# Altium project LCDTestor.PrjPcb
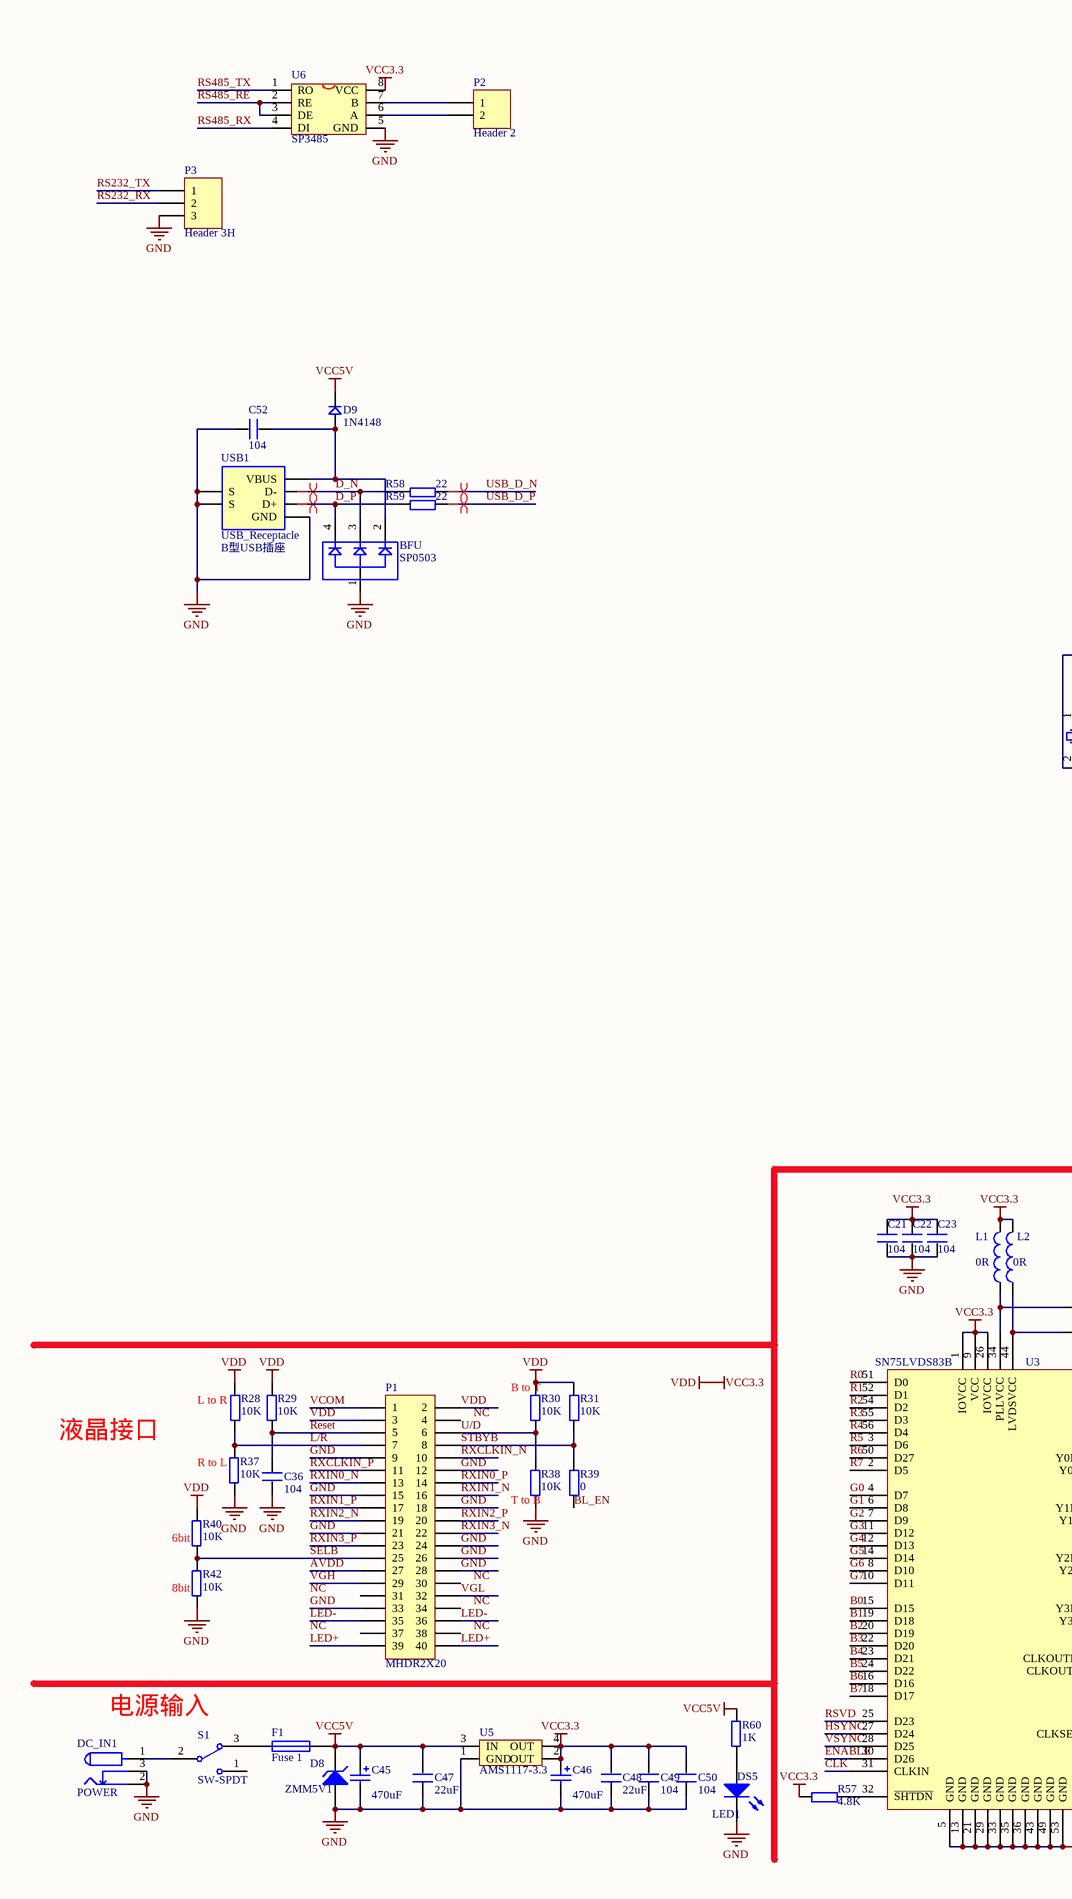
[diagram p0: LCD TEST BOART-A8.SchDoc, left]
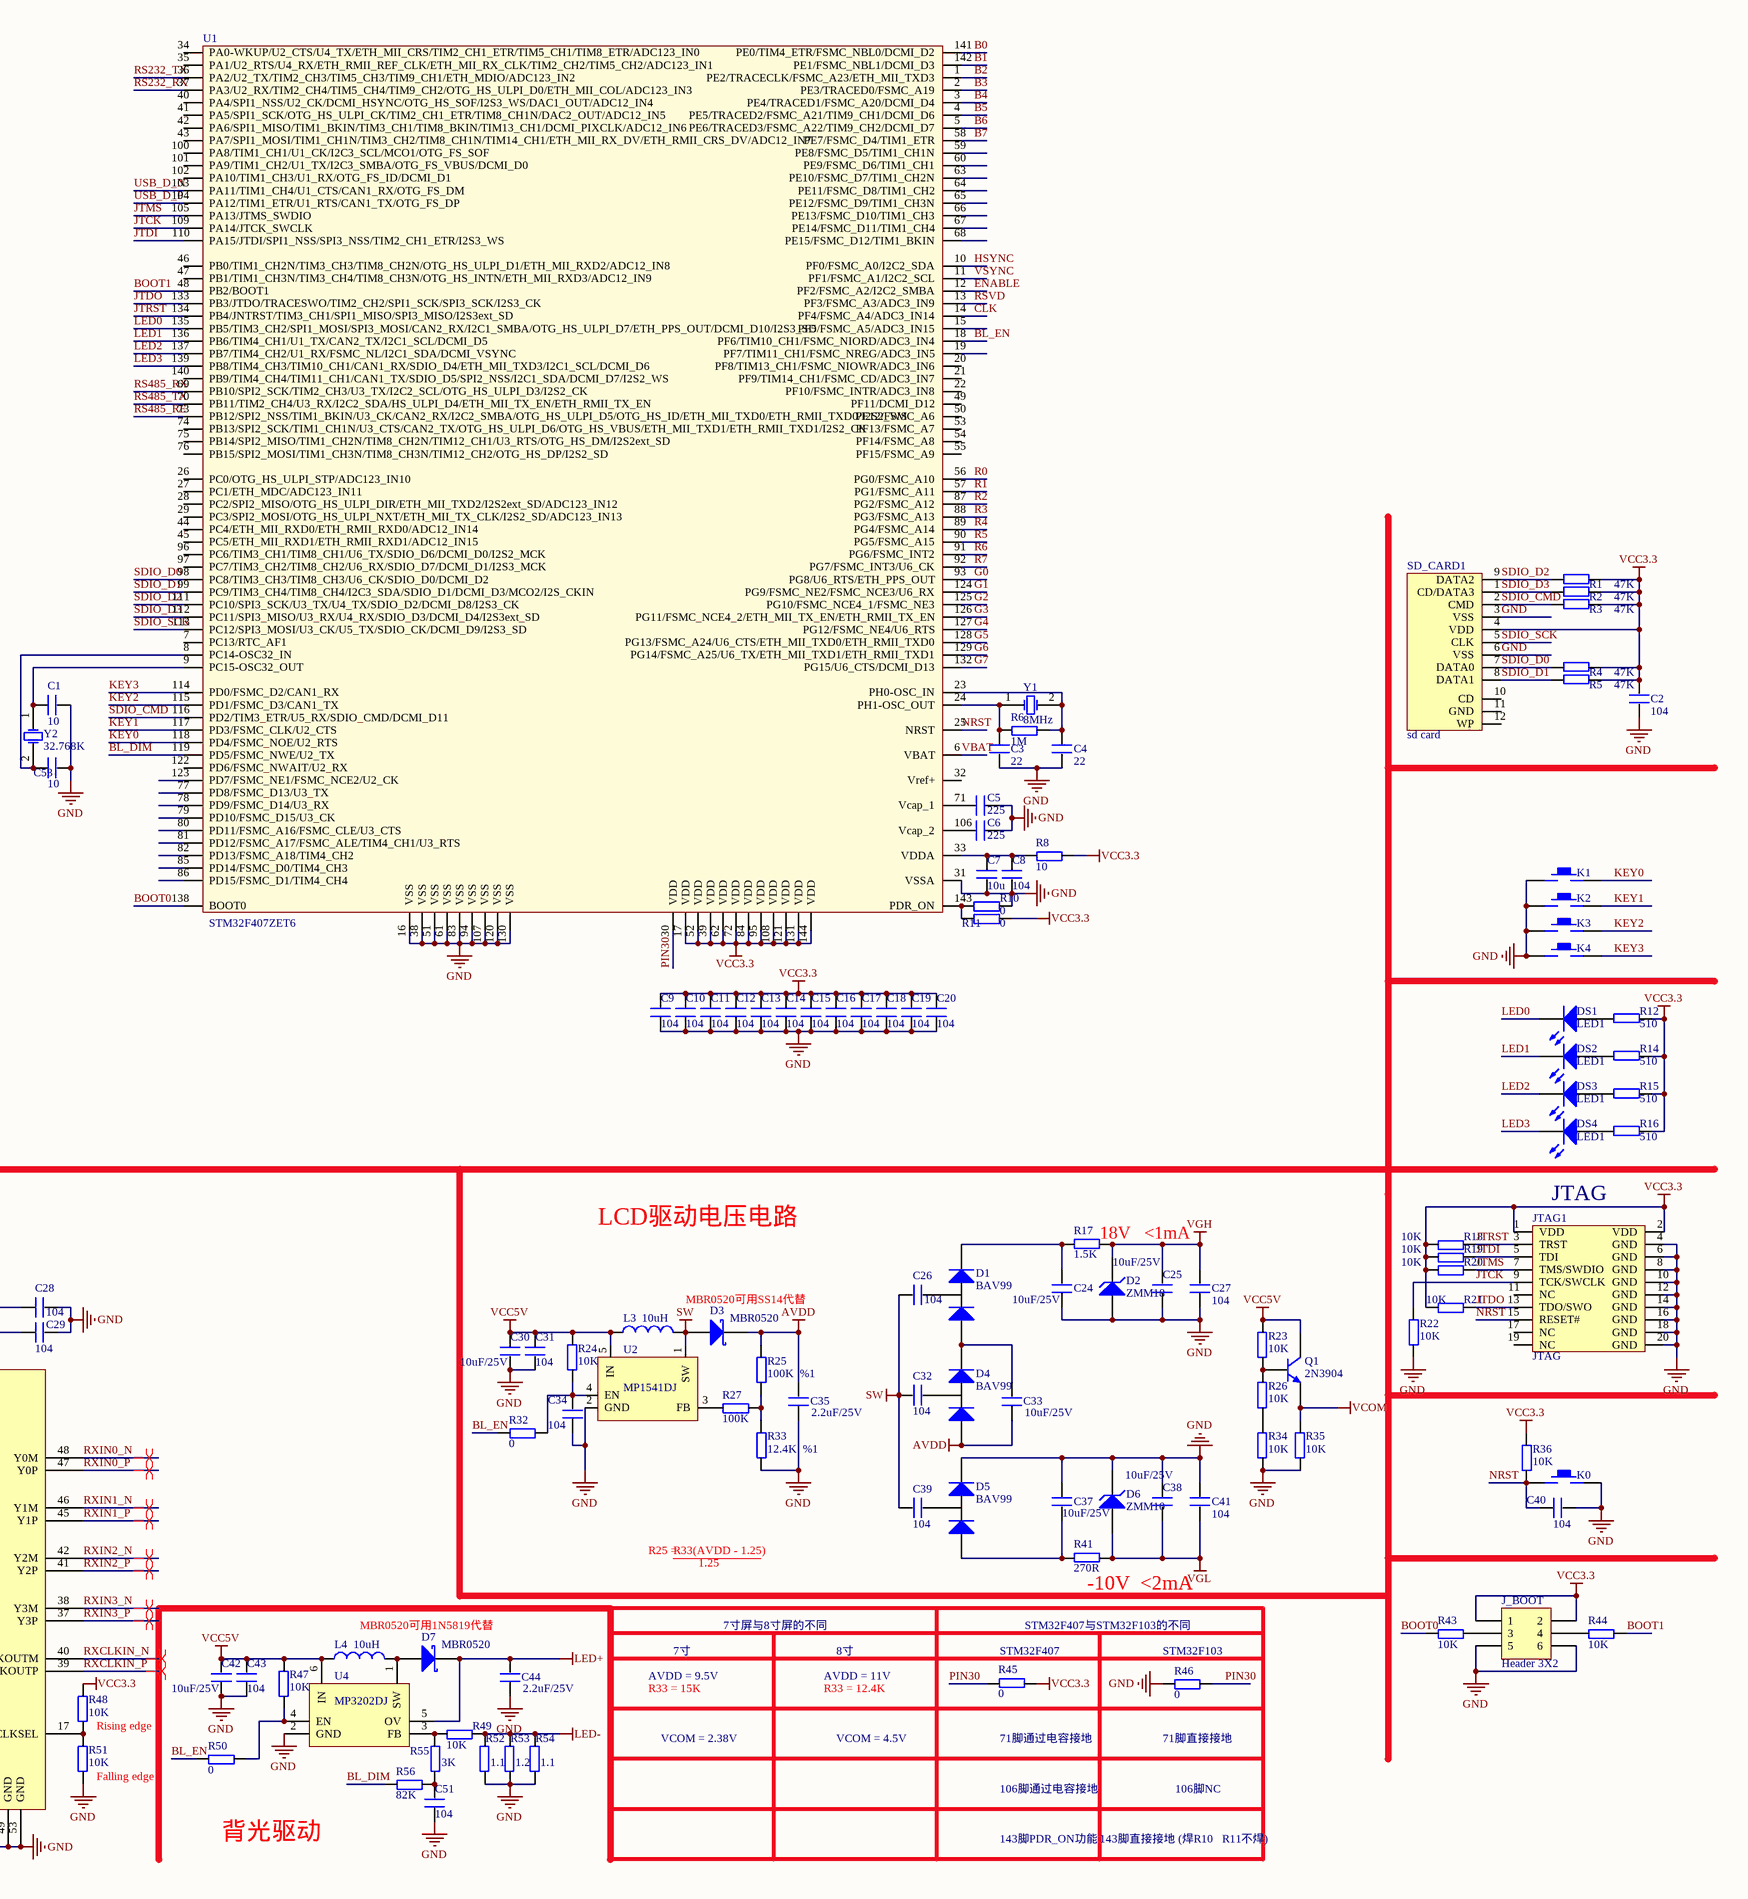
[diagram p1: LCD TEST BOART-A8.SchDoc, right]
1 sheet, 153 parts. Net scope: global (net labels, ports and power ports of the same name join across sheets).
Board file: LCD TEST BOART-A8.PcbDoc

## Sheet LCD TEST BOART-A8.SchDoc
size A2

### Parts
BFU  SP0503  [SOT143]
C1  10  [0603P]
C2  104  [0603P]
C3  22  [0603P]
C4  22  [0603P]
C5  225  [0603P]
C6  225  [0603P]
C7  10u  [0603P]
C8  104  [0603P]
C9  104  [0603P]
C10  104  [0603P]
C11  104  [0603P]
C12  104  [0603P]
C13  104  [0603P]
C14  104  [0603P]
C15  104  [0603P]
C16  104  [0603P]
C17  104  [0603P]
C18  104  [0603P]
C19  104  [0603P]
C20  104  [0603P]
C21  104  [0603P]
C22  104  [0603P]
C23  104  [0603P]
C24  10uF/25V  [1206]
C25  10uF/25V  [1206]
C26  104  [0603P]
C27  104  [0603P]
C28  104  [0603P]
C29  104  [0603P]
C30  10uF/25V  [1206]
C31  104  [0603P]
C32  104  [0603P]
C33  10uF/25V  [1206]
C34  104  [0603P]
C35  2.2uF/25V  [1206]
C36  104  [0603P]
C37  10uF/25V  [1206]
C38  10uF/25V  [1206]
C39  104  [0603P]
C40  104  [0603P]
C41  104  [0603P]
C42  10uF/25V  [1206]
C43  104  [0603P]
C44  2.2uF/25V  [1206]
C45  value 470uF  [7343]  (hidden comment: Cap Tantalum)
C46  value 470uF  [7343]  (hidden comment: Cap Tantalum)
C47  22uF  [0603P]
C48  22uF  [0603P]
C49  104  [0603P]
C50  104  [0603P]
C51  104  [0603P]
C52  104  [0603P]
C53  10  [0603P]
D1  BAV99  [SOT-23-3L]
D2  ZMM18  [LL-34]
D3  MBR0520  [DSO-C2/X2.3]
D4  BAV99  [SOT-23-3L]
D5  BAV99  [SOT-23-3L]
D6  ZMM10  [LL-34]
D7  MBR0520  [DSO-C2/X2.3]
D8  ZMM5V1  [LL-34]
D9  1N4148  [DIODE_SOP]
DC_IN1  POWER  [DC10B]
DS1  LED1  [SMDLED]
DS2  LED1  [SMDLED]
DS3  LED1  [SMDLED]
DS4  LED1  [SMDLED]
DS5  LED1  [SMDLED]
F1  Fuse 1  [0805]
J_BOOT  Header 3X2  [HDR2X3]
JTAG1  JTAG  [JTAG_20]
K0  KEY_M  [K贴片]  (value not drawn)
K1  KEY_M  [K贴片]  (value not drawn)
K2  KEY_M  [K贴片]  (value not drawn)
K3  KEY_M  [K贴片]  (value not drawn)
K4  KEY_M  [K贴片]  (value not drawn)
L1  value 0R  [0603P]  (hidden comment: Inductor)
L2  value 0R  [0603P]  (hidden comment: Inductor)
L3  value 10uH  [1206]  (hidden comment: Inductor)
L4  value 10uH  [1206]  (hidden comment: Inductor)
P1  MHDR2X20  [FH12A-40S-0.5SH]
P2  Header 2  [HDR1X2]
P3  Header 3H  [HDR1X3]
Q1  2N3904  [SOT-23-3L]
R1  47K  [0603P]
R2  47K  [0603P]
R3  47K  [0603P]
R4  47K  [0603P]
R5  47K  [0603P]
R6  1M  [0603P]
R8  10  [0603P]
R10  0  [0603P]
R11  0  [0603P]
R12  510  [0603P]
R14  510  [0603P]
R15  510  [0603P]
R16  510  [0603P]
R17  1.5K  [0603P]
R18  10K  [0603P]
R19  10K  [0603P]
R20  10K  [0603P]
R21  10K  [0603P]
R22  10K  [0603P]
R23  10K  [0603P]
R24  10K  [0603P]
R25  100K  %1  [0603P]
R26  10K  [0603P]
R27  100K  [0603P]
R28  10K  [0603P]
R29  10K  [0603P]
R30  10K  [0603P]
R31  10K  [0603P]
R32  0  [0603P]
R33  12.4K  %1  [0603P]
R34  10K  [0603P]
R35  10K  [0603P]
R36  10K  [0603P]
R37  10K  [0603P]
R38  10K  [0603P]
R39  0  [0603P]
R40  10K  [0603P]
R41  270R  [0603P]
R42  10K  [0603P]
R43  10K  [0603P]
R44  10K  [0603P]
R45  0  [0603P]
R46  0  [0603P]
R47  10K  [0603P]
R48  10K  [0603P]
R49  10K  [0603P]
R50  0  [0603P]
R51  10K  [0603P]
R52  1.1  [0603P]
R53  1.2  [0603P]
R54  1.1  [0603P]
R55  3K  [0603P]
R56  82K  [0603P]
R57  4.8K  [0603P]
R58  22  [0603P]
R59  22  [0603P]
R60  1K  [0603P]
S1  SW-SPDT  [自锁开关6]
SD_CARD1  sd card  [SDCARD_L]
U1  STM32F407ZET6  [LQFP144]
U2  MP1541DJ  [SOT-23-5L]
U3  SN75LVDS83B  [DGG056]
U4  MP3202DJ  [SOT-23-6L]
U5  AMS1117-3.3  [AMS1117]
U6  SP3485  [SOP-8]
USB1  USB_Receptacle  value B型USB插座  [Micro_USB]
Y1  8MHz  [SMD2_50X32]
Y2  32.768K  [XTAL32]

### Nets
AVDD: C33.2 C35.1 D3.2(K) D4.1(A) P1.27 R25.2
GND: BFU.1 C1.2 C2.2 C3.1 C4.1 C5.2 C6.2 C7.1 C8.1 C9.1 C10.1 C11.1 C12.1 C13.1 C14.1 C15.1 C16.1 C17.1 C18.1 C19.1 C20.1 C21.1 C22.1 C23.1 C24.2 C25.2 C27.2 C28.1 C29.1 C30.2 C31.1 C34.1 C35.2 C36.1 C37.1 C38.1 C40.1 C41.1 C42.2 C43.1 C44.2 C45.2 C46.2 C47.1 C48.1 C49.1 C50.1 C51.1 C52.1 C53.2 D2.1(A) D5.2(K) D6.2(K) D8.1(A) DC_IN1.2 DC_IN1.3 DS5.2(K) J_BOOT.5 J_BOOT.6 JTAG1.4(GND) JTAG1.6(GND) JTAG1.8(GND) JTAG1.10(GND) JTAG1.12(GND) JTAG1.14(GND) JTAG1.16(GND) JTAG1.18(GND) JTAG1.20(GND) K0.2 K1.1 K2.1 K3.1 K4.1 P1.9 P1.12 P1.15 P1.18 P1.21 P1.24 P1.26 P1.28 P1.33 P3.3 R10.2 R22.1 R33.1 R34.2 R35.2 R37.2 R38.2 R42.2 R46.1 R51.2 R52.2 R53.2 R54.2 SD_CARD1.3(VSS) SD_CARD1.6(VSS) U1.16(VSS) U1.31(VSSA) U1.38(VSS) U1.51(VSS) U1.61(VSS) U1.83(VSS) U1.94(VSS) U1.107(VSS) U1.120(VSS) U1.130(VSS) U2.2(GND) U3.5(GND) U3.13(GND) U3.21(GND) U3.29(GND) U3.33(GND) U3.35(GND) U3.36(GND) U3.43(GND) U3.49(GND) U3.53(GND) U4.2(GND) U5.1(GND) U6.5(GND) USB1.4(GND) USB1.5(S) USB1.6(S)
LED+: C44.1 D7.2(K) P1.39 P1.40 U4.5(OV)
LED-: P1.35 P1.36 R49.2 R52.1 R53.1 R54.1
SW: C26.2 C32.1 C39.1 D3.1(A) L3.2 U2.1(SW)
VCC5V: C30.1 C31.2 C42.1 C43.2 C45.1 C47.2 D8.2(K) D9.2 F1.2 L3.1 L4.1 Q1.3(C) R23.1 R24.1 R47.1 R60.1 U2.5(IN) U4.6(IN) U5.3(IN)
VCOM: P1.1 Q1.2(E) R35.1
VDD: C2.1 C9.2 C10.2 C11.2 C12.2 C13.2 C14.2 C15.2 C16.2 C17.2 C18.2 C19.2 C20.2 C21.2 C22.2 C23.2 C46.1 C48.2 C49.2 C50.2 J_BOOT.1 J_BOOT.2 JTAG1.1(VDD) JTAG1.2(VDD) L1.2 L2.2 P1.2 P1.3 R1.1 R2.1 R3.1 R4.1 R5.1 R8.2 R11.2 R12.1 R14.1 R15.1 R16.1 R18.1 R19.1 R20.1 R21.1 R28.2 R29.1 R30.1 R31.2 R36.2 R40.1 R45.1 R48.1 R57.1 SD_CARD1.4(VDD) U1.17(VDD) U1.39(VDD) U1.52(VDD) U1.62(VDD) U1.72(VDD) U1.84(VDD) U1.95(VDD) U1.108(VDD) U1.121(VDD) U1.131(VDD) U1.144(VDD) U3.1(IOVCC) U3.9(VCC) U3.26(IOVCC) U5.2(OUT) U5.4(OUT) U6.8(VCC)  [also labelled VCC3.3]
VGH: C25.1 C27.1 D2.2(K) P1.29 R17.1
VGL: C38.2 C41.2 D6.1(A) P1.32 R41.1
B0: U1.141(PE0/TIM4_ETR/FSMC_NBL0/DCMI_D2) U3.15(D15)
B1: U1.142(PE1/FSMC_NBL1/DCMI_D3) U3.19(D18)
B2: U1.1(PE2/TRACECLK/FSMC_A23/ETH_MII_TXD3) U3.20(D19)
B3: U1.2(PE3/TRACED0/FSMC_A19) U3.22(D20)
B4: U1.3(PE4/TRACED1/FSMC_A20/DCMI_D4) U3.23(D21)
B5: U1.4(PE5/TRACED2/FSMC_A21/TIM9_CH1/DCMI_D6) U3.24(D22)
B6: U1.5(PE6/TRACED3/FSMC_A22/TIM9_CH2/DCMI_D7) U3.16(D16)
B7: U1.58(PE7/FSMC_D4/TIM1_ETR) U3.18(D17)
BL_DIM: R56.1 U1.119(PD5/FSMC_NWE/U2_TX)
BL_EN: R32.1 R39.1 R50.1 U1.18(PF6/TIM10_CH1/FSMC_NIORD/ADC3_IN4)
BOOT0: R43.1 U1.138(BOOT0)
BOOT1: R44.2 U1.48(PB2/BOOT1)
CLK: U1.14(PF4/FSMC_A4/ADC3_IN14) U3.31(CLKIN)
D_N: BFU.3 R58.1 USB1.2(D-)
D_P: BFU.4 R59.1 USB1.3(D+)
ENABLE: U1.12(PF2/FSMC_A2/I2C2_SMBA) U3.30(D26)
G0: U1.93(PG8/U6_RTS/ETH_PPS_OUT) U3.4(D7)
G1: U1.124(PG9/FSMC_NE2/FSMC_NCE3/U6_RX) U3.6(D8)
G2: U1.125(PG10/FSMC_NCE4_1/FSMC_NE3) U3.7(D9)
G3: U1.126(PG11/FSMC_NCE4_2/ETH_MII_TX_EN/ETH_RMII_TX_EN) U3.11(D12)
G4: U1.127(PG12/FSMC_NE4/U6_RTS) U3.12(D13)
G5: U1.128(PG13/FSMC_A24/U6_CTS/ETH_MII_TXD0/ETH_RMII_TXD0) U3.14(D14)
G6: U1.129(PG14/FSMC_A25/U6_TX/ETH_MII_TXD1/ETH_RMII_TXD1) U3.8(D10)
G7: U1.132(PG15/U6_CTS/DCMI_D13) U3.10(D11)
HSYNC: U1.10(PF0/FSMC_A0/I2C2_SDA) U3.27(D24)
JTCK: JTAG1.9(TCK/SWCLK) R22.2 U1.109(PA14/JTCK_SWCLK)
JTDI: JTAG1.5(TDI) R19.2 U1.110(PA15/JTDI/SPI1_NSS/SPI3_NSS/TIM2_CH1_ETR/I2S3_WS)
JTDO: JTAG1.13(TDO/SWO) R21.2 U1.133(PB3/JTDO/TRACESWO/TIM2_CH2/SPI1_SCK/SPI3_SCK/I2S3_CK)
JTMS: JTAG1.7(TMS/SWDIO) R20.2 U1.105(PA13/JTMS_SWDIO)
JTRST: JTAG1.3(TRST) R18.2 U1.134(PB4/JNTRST/TIM3_CH1/SPI1_MISO/SPI3_MISO/I2S3ext_SD)
KEY0: K1.2 U1.118(PD4/FSMC_NOE/U2_RTS)
KEY1: K2.2 U1.117(PD3/FSMC_CLK/U2_CTS)
KEY2: K3.2 U1.115(PD1/FSMC_D3/CAN1_TX)
KEY3: K4.2 U1.114(PD0/FSMC_D2/CAN1_RX)
L/R: P1.7 R28.1 R37.1
LED0: DS1.2(K) U1.135(PB5/TIM3_CH2/SPI1_MOSI/SPI3_MOSI/CAN2_RX/I2C1_SMBA/OTG_HS_ULPI_D7/ETH_PPS_OUT/DCMI_D10/I2S3_SD)
LED1: DS2.2(K) U1.136(PB6/TIM4_CH1/U1_TX/CAN2_TX/I2C1_SCL/DCMI_D5)
LED2: DS3.2(K) U1.137(PB7/TIM4_CH2/U1_RX/FSMC_NL/I2C1_SDA/DCMI_VSYNC)
LED3: DS4.2(K) U1.139(PB8/TIM4_CH3/TIM10_CH1/CAN1_RX/SDIO_D4/ETH_MII_TXD3/I2C1_SCL/DCMI_D6)
NRST: C40.2 JTAG1.15(RESET#) K0.1 R36.1 U1.25(NRST)
PIN30: R45.2 R46.2 U1.30(VDD)
R0: U1.56(PG0/FSMC_A10) U3.51(D0)
R1: U1.57(PG1/FSMC_A11) U3.52(D1)
R2: U1.87(PG2/FSMC_A12) U3.54(D2)
R3: U1.88(PG3/FSMC_A13) U3.55(D3)
R4: U1.89(PG4/FSMC_A14) U3.56(D4)
R5: U1.90(PG5/FSMC_A15) U3.3(D6)
R6: U1.91(PG6/FSMC_INT2) U3.50(D27)
R7: U1.92(PG7/FSMC_INT3/U6_CK) U3.2(D5)
Reset: C36.2 P1.5 R29.2
RS232_RX: P3.2 U1.37(PA3/U2_RX/TIM2_CH4/TIM5_CH4/TIM9_CH2/OTG_HS_ULPI_D0/ETH_MII_COL/ADC123_IN3)
RS232_TX: P3.1 U1.36(PA2/U2_TX/TIM2_CH3/TIM5_CH3/TIM9_CH1/ETH_MDIO/ADC123_IN2)
RS485_RE: U1.73(PB12/SPI2_NSS/TIM1_BKIN/U3_CK/CAN2_RX/I2C2_SMBA/OTG_HS_ULPI_D5/OTG_HS_ID/ETH_MII_TXD0/ETH_RMII_TXD0/I2S2_WS) U6.2(RE) U6.3(DE)
RS485_RX: U1.69(PB10/SPI2_SCK/TIM2_CH3/U3_TX/I2C2_SCL/OTG_HS_ULPI_D3/I2S2_CK) U6.4(DI)
RS485_TX: U1.70(PB11/TIM2_CH4/U3_RX/I2C2_SDA/HS_ULPI_D4/ETH_MII_TX_EN/ETH_RMII_TX_EN) U6.1(RO)
RSVD: U1.13(PF3/FSMC_A3/ADC3_IN9) U3.25(D23)
RXCLKIN_N: P1.10 U3.40(CLKOUTM)
RXCLKIN_P: P1.11 U3.39(CLKOUTP)
RXIN0_N: P1.13 U3.48(Y0M)
RXIN0_P: P1.14 U3.47(Y0P)
RXIN1_N: P1.16 U3.46(Y1M)
RXIN1_P: P1.17 U3.45(Y1P)
RXIN2_N: P1.19 U3.42(Y2M)
RXIN2_P: P1.20 U3.41(Y2P)
RXIN3_N: P1.22 U3.38(Y3M)
RXIN3_P: P1.23 U3.37(Y3P)
SDIO_CMD: R3.2 SD_CARD1.2(CMD) U1.116(PD2/TIM3_ETR/U5_RX/SDIO_CMD/DCMI_D11)
SDIO_D0: R4.2 SD_CARD1.7(DATA0) U1.98(PC8/TIM3_CH3/TIM8_CH3/U6_CK/SDIO_D0/DCMI_D2)
SDIO_D1: R5.2 SD_CARD1.8(DATA1) U1.99(PC9/TIM3_CH4/TIM8_CH4/I2C3_SDA/SDIO_D1/DCMI_D3/MCO2/I2S_CKIN)
SDIO_D2: R1.2 SD_CARD1.9(DATA2) U1.111(PC10/SPI3_SCK/U3_TX/U4_TX/SDIO_D2/DCMI_D8/I2S3_CK)
SDIO_D3: R2.2 SD_CARD1.1(CD/DATA3) U1.112(PC11/SPI3_MISO/U3_RX/U4_RX/SDIO_D3/DCMI_D4/I2S3ext_SD)
SDIO_SCK: SD_CARD1.5(CLK) U1.113(PC12/SPI3_MOSI/U3_CK/U5_TX/SDIO_CK/DCMI_D9/I2S3_SD)
SELB: P1.25 R40.2 R42.1
STBYB: P1.8 R31.1 R39.2
U/D: P1.6 R30.2 R38.1
USB_D_N: R58.2 U1.103(PA11/TIM1_CH4/U1_CTS/CAN1_RX/OTG_FS_DM)
USB_D_P: R59.2 U1.104(PA12/TIM1_ETR/U1_RTS/CAN1_TX/OTG_FS_DP)
VBAT: U1.6(VBAT)
VSYNC: U1.11(PF1/FSMC_A1/I2C2_SCL) U3.28(D25)
NetBFU_2: BFU.2 C52.2 D9.1 USB1.1(VBUS)
NetC1_1: C1.1 U1.9(PC15-OSC32_OUT) Y2.1(OSC1)
NetC3_2: C3.2 R6.1 U1.24(PH1-OSC_OUT) Y1.1(OSC1)
NetC4_2: C4.2 R6.2 U1.23(PH0-OSC_IN) Y1.2(OSC2)
NetC5_1: C5.1 U1.71(Vcap_1)
NetC6_1: C6.1 U1.106(Vcap_2)
NetC7_2: C7.2 C8.2 R8.1 U1.33(VDDA)
NetC24_1: C24.1 D1.2(K) R17.2
NetC26_1: C26.1 D1.3(A)
NetC28_2: C28.2 L1.1 U3.34(PLLVCC)
NetC29_2: C29.2 L2.1 U3.44(LVDSVCC)
NetC32_2: C32.2 D4.3(A)
NetC33_1: C33.1 D1.1(A) D4.2(K)
NetC34_2: C34.2 R24.2 R32.2 U2.4(EN)
NetC37_2: C37.2 D5.1(A) R41.2
NetC39_2: C39.2 D5.3(A)
NetC51_2: C51.2 R55.1 R56.2
NetC53_1: C53.1 U1.8(PC14-OSC32_IN) Y2.2(OSC2)
NetD7_1: D7.1(A) L4.2 U4.1(SW)
NetDC_IN1_1: DC_IN1.1 S1.2
NetDS1_1: DS1.1(A) R12.2
NetDS2_1: DS2.1(A) R14.2
NetDS3_1: DS3.1(A) R15.2
NetDS4_1: DS4.1(A) R16.2
NetDS5_1: DS5.1(A) R60.2
NetF1_1: F1.1 S1.3
NetJ_BOOT_3: J_BOOT.3 R43.2
NetJ_BOOT_4: J_BOOT.4 R44.1
NetP2_1: P2.1 U6.7(B)
NetP2_2: P2.2 U6.6(A)
NetQ1_1: Q1.1(B) R23.2 R26.1
NetR10_1: R10.1 R11.1 U1.143(PDR_ON)
NetR25_1: R25.1 R27.2 R33.2
NetR26_2: R26.2 R34.1
NetR27_1: R27.1 U2.3(FB)
NetR47_2: R47.2 R50.2 U4.4(EN)
NetR48_2: R48.2 R51.1 U3.17(CLKSEL)
NetR49_1: R49.1 R55.2 U4.3(FB)
NetR57_2: R57.2 U3.32(~{SHTDN})

Not connected (* = marked no-connect by the designer): JTAG1 11(NC) 17(NC) 19(NC); P1 4 30 31 34 37 38; S1 1; SD_CARD1 10(CD) 11(GND) 12(WP); U1 7(PC13/RTC_AF1) 15(PF5/FSMC_A5/ADC3_IN15) 19(PF7/TIM11_CH1/FSMC_NREG/ADC3_IN5) 20(PF8/TIM13_CH1/FSMC_NIOWR/ADC3_IN6) 21(PF9/TIM14_CH1/FSMC_CD/ADC3_IN7) 22(PF10/FSMC_INTR/ADC3_IN8) 26(PC0/OTG_HS_ULPI_STP/ADC123_IN10) 27(PC1/ETH_MDC/ADC123_IN11) 28(PC2/SPI2_MISO/OTG_HS_ULPI_DIR/ETH_MII_TXD2/I2S2ext_SD/ADC123_IN12) 29(PC3/SPI2_MOSI/OTG_HS_ULPI_NXT/ETH_MII_TX_CLK/I2S2_SD/ADC123_IN13) 32(Vref+) 34(PA0-WKUP/U2_CTS/U4_TX/ETH_MII_CRS/TIM2_CH1_ETR/TIM5_CH1/TIM8_ETR/ADC123_IN0) 35(PA1/U2_RTS/U4_RX/ETH_RMII_REF_CLK/ETH_MII_RX_CLK/TIM2_CH2/TIM5_CH2/ADC123_IN1) 40(PA4/SPI1_NSS/U2_CK/DCMI_HSYNC/OTG_HS_SOF/I2S3_WS/DAC1_OUT/ADC12_IN4) 41(PA5/SPI1_SCK/OTG_HS_ULPI_CK/TIM2_CH1_ETR/TIM8_CH1N/DAC2_OUT/ADC12_IN5) 42(PA6/SPI1_MISO/TIM1_BKIN/TIM3_CH1/TIM8_BKIN/TIM13_CH1/DCMI_PIXCLK/ADC12_IN6) 43(PA7/SPI1_MOSI/TIM1_CH1N/TIM3_CH2/TIM8_CH1N/TIM14_CH1/ETH_MII_RX_DV/ETH_RMII_CRS_DV/ADC12_IN7) 44(PC4/ETH_MII_RXD0/ETH_RMII_RXD0/ADC12_IN14) 45(PC5/ETH_MII_RXD1/ETH_RMII_RXD1/ADC12_IN15) 46(PB0/TIM1_CH2N/TIM3_CH3/TIM8_CH2N/OTG_HS_ULPI_D1/ETH_MII_RXD2/ADC12_IN8) 47(PB1/TIM1_CH3N/TIM3_CH4/TIM8_CH3N/OTG_HS_INTN/ETH_MII_RXD3/ADC12_IN9) 49(PF11/DCMI_D12) 50(PF12/FSMC_A6) 53(PF13/FSMC_A7) 54(PF14/FSMC_A8) 55(PF15/FSMC_A9) 59(PE8/FSMC_D5/TIM1_CH1N) 60(PE9/FSMC_D6/TIM1_CH1) 63(PE10/FSMC_D7/TIM1_CH2N) 64(PE11/FSMC_D8/TIM1_CH2) 65(PE12/FSMC_D9/TIM1_CH3N) 66(PE13/FSMC_D10/TIM1_CH3) 67(PE14/FSMC_D11/TIM1_CH4) 68(PE15/FSMC_D12/TIM1_BKIN) 74(PB13/SPI2_SCK/TIM1_CH1N/U3_CTS/CAN2_TX/OTG_HS_ULPI_D6/OTG_HS_VBUS/ETH_MII_TXD1/ETH_RMII_TXD1/I2S2_CK) 75(PB14/SPI2_MISO/TIM1_CH2N/TIM8_CH2N/TIM12_CH1/U3_RTS/OTG_HS_DM/I2S2ext_SD) 76(PB15/SPI2_MOSI/TIM1_CH3N/TIM8_CH3N/TIM12_CH2/OTG_HS_DP/I2S2_SD) 77(PD8/FSMC_D13/U3_TX) 78(PD9/FSMC_D14/U3_RX) 79(PD10/FSMC_D15/U3_CK) 80(PD11/FSMC_A16/FSMC_CLE/U3_CTS) 81(PD12/FSMC_A17/FSMC_ALE/TIM4_CH1/U3_RTS) 82(PD13/FSMC_A18/TIM4_CH2) 85(PD14/FSMC_D0/TIM4_CH3) 86(PD15/FSMC_D1/TIM4_CH4) 96(PC6/TIM3_CH1/TIM8_CH1/U6_TX/SDIO_D6/DCMI_D0/I2S2_MCK) 97(PC7/TIM3_CH2/TIM8_CH2/U6_RX/SDIO_D7/DCMI_D1/I2S3_MCK) 100(PA8/TIM1_CH1/U1_CK/I2C3_SCL/MCO1/OTG_FS_SOF) 101(PA9/TIM1_CH2/U1_TX/I2C3_SMBA/OTG_FS_VBUS/DCMI_D0) 102(PA10/TIM1_CH3/U1_RX/OTG_FS_ID/DCMI_D1) 122(PD6/FSMC_NWAIT/U2_RX) 123(PD7/FSMC_NE1/FSMC_NCE2/U2_CK) 140(PB9/TIM4_CH4/TIM11_CH1/CAN1_TX/SDIO_D5/SPI2_NSS/I2C1_SDA/DCMI_D7/I2S2_WS)

### Layout directives
differential pair: (no net found under the mark), RXCLKIN_N, RXCLKIN_P, RXIN0_N, RXIN0_P, RXIN1_N, RXIN1_P, RXIN2_N, RXIN2_P, RXIN3_N, RXIN3_P, USB_D_N, USB_D_P

### Notes on the sheet
- LCD驱动电压电路
- (near JTAG1) JTAG
- (near R17) 18V   <1mA
- MBR0520可用SS14代替
- (near R28) L to R
- (near R30) B to T
- 液晶接口
- (near R37) R to L
- (near R40) 6bit
- (near R38) T to B
- (near R42) 8bit
- R25 =
- R33(AVDD - 1.25)
- 1.25
- (near R41) -10V  <2mA
- MBR0520可用1N5819代替
- 7寸
- 7寸屏与8寸屏的不同
- 8寸
- (near R45) STM32F407
- STM32F407与STM32F103的不同
- (near R46) STM32F103
- 电源输入
- Rising edge
- AVDD = 9.5V
- R33 = 15K
- AVDD = 11V
- R33 = 12.4K
- (near R51) Falling edge
- VCOM = 2.38V
- VCOM = 4.5V
- 71脚通过电容接地
- 106脚通过电容接地
- 71脚直接接地
- 106脚NC
- 背光驱动
- 143脚PDR_ON功能
- 143脚直接接地 (焊R10   R11不焊)
- Labels drawn without touching a wire or pin: NC

### Library data of the parts
BFU = SP0503: Capacitor; Published: *; Publisher: *; Manufacturer: *; Class: *; SubClass: *; Value: *
C1 C47-C50 C52 C53 = C_2
C2-C44 C51 = C
C45 C46 = Cap Tantalum: Polarized Capacitor (Surface Mount); Published: LatestRevisionDate; LatestRevisionDate: 2014-11-15; LatestRevisionNote: IPC-7351 Footprint Added.; PackageReference: C0805; Publisher: Am; PackageDescription: Chip Capacitor
D2 D6 D8 = D Zener: Zener Diode; Published: 8-Jun-2000; LatestRevisionDate: 17-Jul-2002; LatestRevisionNote: Re-released for DXP Platform.; PackageReference: DIODE-0.7; Publisher: Altium Limited
D3 D7 = D Schottky: Schottky Diode; Published: 8-Jun-2000; LatestRevisionDate: 17-Jul-2002; LatestRevisionNote: Re-released for DXP Platform.; PackageReference: SMB; Publisher: Altium Limited; Code_JEDEC: DO-214-AA
D9 = D
DC_IN1 = POW
DS1-DS5 = LED2: Typical RED, GREEN, YELLOW, AMBER GaAs LED; Published: 8-Jun-2000; LatestRevisionDate: 17-Jul-2002; LatestRevisionNote: Re-released for DXP Platform.; PackageDocument: Feb-2002; PackageReference: 3.2X1.6X1.1; Publisher: Altium Limited
F1 = Fuse 1: Fuse; Published: 8-Jun-2000; LatestRevisionDate: 17-Jul-2002; LatestRevisionNote: Re-released for DXP Platform.; PackageReference: PIN-W2/E2.8; Publisher: Altium Limited
J_BOOT = Header 3X2: Header, 3-Pin, Dual row; LatestRevisionDate: 17-Jul-2002; LatestRevisionNote: Re-released for DXP Platform.; Publisher: Altium Limited
L1-L4 = Inductor: Code_IEC: 1005; Published: 8-Jun-2000; LatestRevisionDate: 29-May-2009; LatestRevisionNote: IPC-7351 Footprint Added.; PackageReference: 0402-A; Publisher: Altium Limited; PackageDescription: Chip Inductor; Code_JEITA: 0402
P1 = MHDR2X20: Header, 20-Pin, Dual row; LatestRevisionDate: 17-Jul-2002; LatestRevisionNote: Re-released for DXP Platform.; Publisher: Altium Limited
P2 = Header 2: Header, 2-Pin; LatestRevisionDate: 17-Jul-2002; LatestRevisionNote: Re-released for DXP Platform.; Publisher: Altium Limited
P3 = Header 3H: Header, 3-Pin, Right Angle; LatestRevisionDate: 17-Jul-2002; LatestRevisionNote: Re-released for DXP Platform.; Publisher: Altium Limited
Q1 = 2N3904: NPN General Purpose Amplifier; Published: 8-Jun-2000; LatestRevisionDate: 15-Jan-2003; LatestRevisionNote: PCB Footprint 'BCY-W3/D4.7' replaced; DatasheetVersion: 1997; PackageVersion: Sep-1998; PackageReference: TO-92A; Publisher: Altium Limited; Code_JEDEC: TO-92A; ComponentLink1Description: Manufacturer Link; ComponentLink1URL: http://www.fairchildsemi.com/; ComponentLink2Description: Datasheet; ComponentLink2URL: http://www.fairchildsemi.com/ds/2N%2F2N3904.pdf
R1-R6 R8 R10-R12 R14-R60 = R
S1 = SW-SPDT: SPDT Subminiature Toggle Switch, Right Angle Mounting, Vertical Actuation; Published: 24-Mar-1999; LatestRevisionDate: 17-Dec-2003; LatestRevisionNote: Schematic revised, PCB Footprint replaced.; DatasheetVersion: 05-Dec-2000; PackageReference: TL36WW15050; Publisher: Altium Limited; ComponentLink1Description: Manufacturer Link; ComponentLink1URL: http://www.apem.com
U2 = MP1541
U4 = MP3202
U5 = AMS1117
U6 = MAX3485
USB1 = 300008272: B型USB插座，Series “B” Receptacles，Right Angle, T/H，4POS; Part name: USB插座; ID: 273; Part Number: 300008272; Part Type: USB插座; DataSheet: \\dsvr\1_研发团队\1_研发资源\HW\Lib_Datasheet\conn\usb\UC11123-LK1-4F_B_type.pdf
Y1 = XTAL: Crystal Oscillator; Published: 8-Jun-2000; LatestRevisionDate: 17-Jul-2002; LatestRevisionNote: Re-released for DXP Platform.; Publisher: Altium Limited
Y2 = XTAL_1: Crystal Oscillator; Published: 8-Jun-2000; LatestRevisionDate: 17-Jul-2002; LatestRevisionNote: Re-released for DXP Platform.; Publisher: Altium Limited